# Altium project Shuttler_AFE.PrjPCB (part 1 of 2)
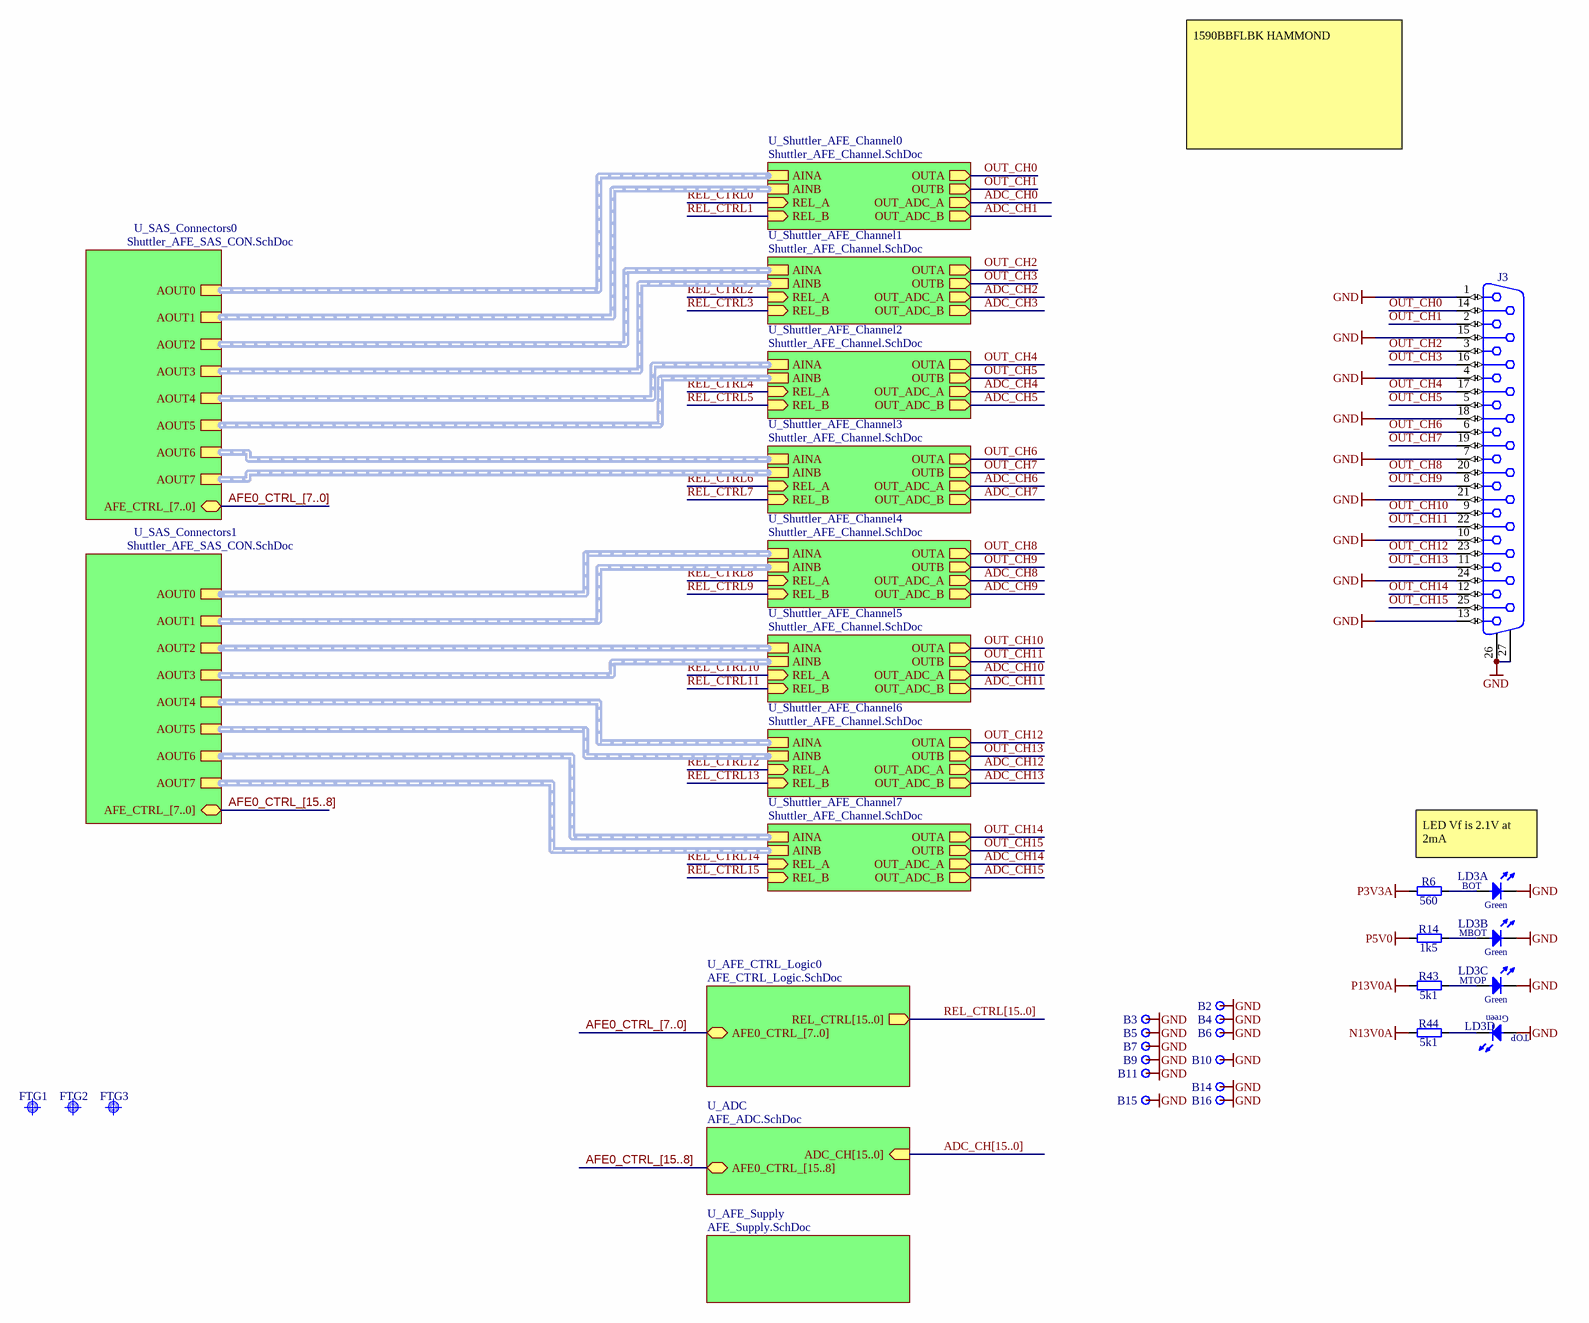
[diagram p0: Shuttler_AFE.SchDoc]
P_version: 1.2
6 sheets, 540 parts. Net scope: hierarchical (ports join the sheet entries above them; power ports are global).
Board file: Shuttler_AFE.PcbDoc
Sheets:
  Shuttler_AFE.SchDoc
    U_SAS_Connectors0 = Shuttler_AFE_SAS_CON.SchDoc
    U_SAS_Connectors1 = Shuttler_AFE_SAS_CON.SchDoc
    U_Shuttler_AFE_Channel0 = Shuttler_AFE_Channel.SchDoc
    U_AFE_CTRL_Logic0 = AFE_CTRL_Logic.SchDoc
    U_Shuttler_AFE_Channel1 = Shuttler_AFE_Channel.SchDoc
    U_Shuttler_AFE_Channel2 = Shuttler_AFE_Channel.SchDoc
    U_Shuttler_AFE_Channel3 = Shuttler_AFE_Channel.SchDoc
    U_Shuttler_AFE_Channel4 = Shuttler_AFE_Channel.SchDoc
    U_Shuttler_AFE_Channel5 = Shuttler_AFE_Channel.SchDoc
    U_Shuttler_AFE_Channel6 = Shuttler_AFE_Channel.SchDoc
    U_Shuttler_AFE_Channel7 = Shuttler_AFE_Channel.SchDoc
    U_ADC = AFE_ADC.SchDoc
    U_AFE_Supply = AFE_Supply.SchDoc

## Sheet Shuttler_AFE.SchDoc: Shuttler AFE
size 420 x 297 mm; Author: G.Kasprowicz; CompanyName: WUT ISE; DrawnBy: G.Kasprowicz; Organization: WUT ISE; Address1: PW ISE; Address2: Nowowiejska 15/19 00-665 Warsaw; Address3: gkasprow@gmail.com; DocumentNumber: 1; Revision: 1.2; SheetNumber: 1; SheetTotal: 6; ModifiedBy: -; CheckedDate: -; Title2: TOP; DivGrp: WUT ISE; Designer: G.Kasprowicz; ModifiedDate: -; ProjectName: Sensor Box

### Parts
B2  Plated Hole  [MTG270_500]  (value not drawn)  (no BOM)
B3  Plated Hole  [MTG270_500]  (value not drawn)  (no BOM)
B4  Plated Hole  [MTG270_500]  (value not drawn)  (no BOM)
B5  Plated Hole  [MTG270_500]  (value not drawn)  (no BOM)
B6  Plated Hole  [MTG270_500]  (value not drawn)  (no BOM)
B7  Plated Hole  [MTG270_500]  (value not drawn)  (no BOM)
B9  Plated Hole  [MTG270_500]  (value not drawn)  (no BOM)
B10  Plated Hole  [MTG270_500]  (value not drawn)  (no BOM)
B11  Plated Hole  [MTG270_500]  (value not drawn)  (no BOM)
B14  Plated Hole  [MTG270_500]  (value not drawn)  (no BOM)
B15  Plated Hole  [MTG270_500]  (value not drawn)  (no BOM)
B16  Plated Hole  [MTG270_500]  (value not drawn)  (no BOM)
FTG1  Use only in PCB  [FIDUCIAL_TOP_S100-200]  (value not drawn)
FTG2  Use only in PCB  [FIDUCIAL_TOP_S100-200]  (value not drawn)
FTG3  Use only in PCB  [FIDUCIAL_TOP_S100-200]  (value not drawn)
J3  D-Sub  [TYCO_3-1634586-2]  (value not drawn)
LD3  Green  [LED_BIVAR_H485CGDL]  (value not drawn)  (parts A,B,C,D of 4)
R6  560  [RESC1608X55N]
R14  1k5  [RESC1608X55N]
R43  5k1  [RESC1608X55N]
R44  5k1  [RESC1608X55N]

### Sub-sheets
U_ADC = AFE_ADC.SchDoc: ADC_CH[15..0] (in), AFE0_CTRL_[15..8] (bidir)
U_AFE_CTRL_Logic0 = AFE_CTRL_Logic.SchDoc: REL_CTRL[15..0] (out), AFE0_CTRL_[7..0] (bidir)
U_AFE_Supply = AFE_Supply.SchDoc: no entries
U_SAS_Connectors0 = Shuttler_AFE_SAS_CON.SchDoc: AOUT4 (harness DIFF), AOUT0 (harness DIFF), AOUT1 (harness DIFF), AOUT2 (harness DIFF), AOUT6 (harness DIFF), AOUT7 (harness DIFF), AFE_CTRL_[7..0] (bidir), AOUT3 (harness DIFF), AOUT5 (harness DIFF)
U_SAS_Connectors1 = Shuttler_AFE_SAS_CON.SchDoc: AOUT4 (harness DIFF), AOUT0 (harness DIFF), AOUT1 (harness DIFF), AOUT2 (harness DIFF), AOUT6 (harness DIFF), AOUT7 (harness DIFF), AFE_CTRL_[7..0] (bidir), AOUT3 (harness DIFF), AOUT5 (harness DIFF)
U_Shuttler_AFE_Channel0 = Shuttler_AFE_Channel.SchDoc: AINA (harness DIFF), OUTA (out), AINB (harness DIFF), OUTB (out), REL_A (in), REL_B (in), OUT_ADC_A (out), OUT_ADC_B (out)
U_Shuttler_AFE_Channel1 = Shuttler_AFE_Channel.SchDoc: AINA (harness DIFF), OUTA (out), AINB (harness DIFF), OUTB (out), REL_A (in), REL_B (in), OUT_ADC_A (out), OUT_ADC_B (out)
U_Shuttler_AFE_Channel2 = Shuttler_AFE_Channel.SchDoc: AINA (harness DIFF), OUTA (out), AINB (harness DIFF), OUTB (out), REL_A (in), REL_B (in), OUT_ADC_A (out), OUT_ADC_B (out)
U_Shuttler_AFE_Channel3 = Shuttler_AFE_Channel.SchDoc: AINA (harness DIFF), OUTA (out), AINB (harness DIFF), OUTB (out), REL_A (in), REL_B (in), OUT_ADC_A (out), OUT_ADC_B (out)
U_Shuttler_AFE_Channel4 = Shuttler_AFE_Channel.SchDoc: AINA (harness DIFF), OUTA (out), AINB (harness DIFF), OUTB (out), REL_A (in), REL_B (in), OUT_ADC_A (out), OUT_ADC_B (out)
U_Shuttler_AFE_Channel5 = Shuttler_AFE_Channel.SchDoc: AINA (harness DIFF), OUTA (out), AINB (harness DIFF), OUTB (out), REL_A (in), REL_B (in), OUT_ADC_A (out), OUT_ADC_B (out)
U_Shuttler_AFE_Channel6 = Shuttler_AFE_Channel.SchDoc: AINA (harness DIFF), OUTA (out), AINB (harness DIFF), OUTB (out), REL_A (in), REL_B (in), OUT_ADC_A (out), OUT_ADC_B (out)
U_Shuttler_AFE_Channel7 = Shuttler_AFE_Channel.SchDoc: AINA (harness DIFF), OUTA (out), AINB (harness DIFF), OUTB (out), REL_A (in), REL_B (in), OUT_ADC_A (out), OUT_ADC_B (out)

### Nets
GND: B2.1 B3.1 B4.1 B5.1 B6.1 B7.1 B9.1 B10.1 B11.1 B14.1 B15.1 B16.1 J3.1 J3.4 J3.7 J3.10 J3.13 J3.15 J3.18 J3.21 J3.24 J3.26 J3.27 LD3.1(C) LD3.3(C) LD3.5(C) LD3.8(A)
N13V0A: R44.1
P3V3A: R6.1
P5V0: R14.1
P13V0A: R43.1
OUT_CH0: J3.14 ; sheet U_Shuttler_AFE_Channel0/OUTA
OUT_CH1: J3.2 ; sheet U_Shuttler_AFE_Channel0/OUTB
OUT_CH2: J3.3 ; sheet U_Shuttler_AFE_Channel1/OUTA
OUT_CH3: J3.16 ; sheet U_Shuttler_AFE_Channel1/OUTB
OUT_CH4: J3.17 ; sheet U_Shuttler_AFE_Channel2/OUTA
OUT_CH5: J3.5 ; sheet U_Shuttler_AFE_Channel2/OUTB
OUT_CH6: J3.6 ; sheet U_Shuttler_AFE_Channel3/OUTA
OUT_CH7: J3.19 ; sheet U_Shuttler_AFE_Channel3/OUTB
OUT_CH8: J3.20 ; sheet U_Shuttler_AFE_Channel4/OUTA
OUT_CH9: J3.8 ; sheet U_Shuttler_AFE_Channel4/OUTB
OUT_CH10: J3.9 ; sheet U_Shuttler_AFE_Channel5/OUTA
OUT_CH11: J3.22 ; sheet U_Shuttler_AFE_Channel5/OUTB
OUT_CH12: J3.23 ; sheet U_Shuttler_AFE_Channel6/OUTA
OUT_CH13: J3.11 ; sheet U_Shuttler_AFE_Channel6/OUTB
OUT_CH14: J3.12 ; sheet U_Shuttler_AFE_Channel7/OUTA
OUT_CH15: J3.25 ; sheet U_Shuttler_AFE_Channel7/OUTB
NetLD3_2: LD3.2(A) R6.2
NetLD3_4: LD3.4(A) R14.2
NetLD3_6: LD3.6(A) R43.2
NetLD3_7: LD3.7(C) R44.2

### Buses and harness runs
bus ADC_CH[15..0] = sheet U_ADC/ADC_CH[15..0]
bus AFE0_CTRL_[7..0] = sheet U_AFE_CTRL_Logic0/AFE0_CTRL_[7..0]
bus AFE0_CTRL_[7..0] = sheet U_SAS_Connectors0/AFE_CTRL_[7..0]
bus AFE0_CTRL_[15..8] = sheet U_ADC/AFE0_CTRL_[15..8]
bus AFE0_CTRL_[15..8] = sheet U_SAS_Connectors1/AFE_CTRL_[7..0]
bus REL_CTRL[15..0] = sheet U_AFE_CTRL_Logic0/REL_CTRL[15..0]
harness sheet U_SAS_Connectors0/AOUT0 = sheet U_Shuttler_AFE_Channel0/AINA
harness sheet U_SAS_Connectors0/AOUT1 = sheet U_Shuttler_AFE_Channel0/AINB
harness sheet U_SAS_Connectors0/AOUT2 = sheet U_Shuttler_AFE_Channel1/AINA
harness sheet U_SAS_Connectors0/AOUT3 = sheet U_Shuttler_AFE_Channel1/AINB
harness sheet U_SAS_Connectors0/AOUT4 = sheet U_Shuttler_AFE_Channel2/AINA
harness sheet U_SAS_Connectors0/AOUT5 = sheet U_Shuttler_AFE_Channel2/AINB
harness sheet U_SAS_Connectors0/AOUT6 = sheet U_Shuttler_AFE_Channel3/AINA
harness sheet U_SAS_Connectors0/AOUT7 = sheet U_Shuttler_AFE_Channel3/AINB
harness sheet U_SAS_Connectors1/AOUT0 = sheet U_Shuttler_AFE_Channel4/AINA
harness sheet U_SAS_Connectors1/AOUT1 = sheet U_Shuttler_AFE_Channel4/AINB
harness sheet U_SAS_Connectors1/AOUT2 = sheet U_Shuttler_AFE_Channel5/AINA
harness sheet U_SAS_Connectors1/AOUT3 = sheet U_Shuttler_AFE_Channel5/AINB
harness sheet U_SAS_Connectors1/AOUT4 = sheet U_Shuttler_AFE_Channel6/AINA
harness sheet U_SAS_Connectors1/AOUT5 = sheet U_Shuttler_AFE_Channel6/AINB
harness sheet U_SAS_Connectors1/AOUT6 = sheet U_Shuttler_AFE_Channel7/AINA
harness sheet U_SAS_Connectors1/AOUT7 = sheet U_Shuttler_AFE_Channel7/AINB

### Notes on the sheet
- 1590BBFLBK HAMMOND
- LED Vf is 2.1V at 2mA
- Project/Equipment
- Document
- Designer
- Drawn by
- Check.by
- Copyright WUT ISE 2018.
  This documentation describes Open Hardware and is licensed under the CERN OHL v.1.1. You may redistribute and modify this documentation under the terms of the CERN OHL v.1.1. (http://ohwr.org/CERNOHL). This documentation is distributed WITHOUT ANY EXPRESS OR IMPLIED WARRANTY, INCLUDING OF MERCHANTABILITY, SATISFACTORY QUALITY AND FITNESS FOR A PARTICULAR PURPOSE. Please see the CERN OHL v.1.1 for applicable conditions.
- Contact
- File
- Last Mod.
- Print Date
- Sheet
- Size
- A3
- of
- Rev
- (in symbol LED_BIVAR_H485CGDL, part A) BOT
- (in symbol LED_BIVAR_H485CGDL, part B) MBOT
- (in symbol LED_BIVAR_H485CGDL, part C) MTOP
- (in symbol LED_BIVAR_H485CGDL, part D) TOP

### Library data of the parts
B2-B7 B9-B11 B14-B16 = PLATED_HOLE2.7_PAD5.0: Single Terminal Socket; Part Description: Plated Through Hole: Hole Dia.=2.7mm Pad Dia.=5.0mm; Mounted: No; Part Number: PLATED_HOLE2.7_PAD5.0; Component Type: Standard (No BOM); Pin Count: 1; Family: Plated Hole; Socket: No; SMD: No; Sense: No; Status: None; ComponentHeight: 0mm; HelpURL: Undefined; Author: CERN DEM JMW; CreateDate: 27.09.2011; LatestRevisionDate: 27.09.2011; PackageDescription: Plated Through Hole: Hole Dia.=2.7mm Pad Dia.=5.0mm
FTG1-FTG3 = FIDUCIAL_TARGET_S100-200: Fiducial Target; Part Description: Square Fiducial Target, Top Layer, 1.0mm, Top Solder 2.0mm, Keepout =2.0mm; Mounted: No; Table: Pads; Part Number: FIDUCIAL_TARGET_S100-200; Component Kind: Standard (No BOM); Component Type: Standard (No BOM); Pin Count: 1; Family: Fiducial; Socket: No; SMD: Yes; Status: None; ComponentHeight: 0mm; Author: CERN DEM JLC; CreateDate: 9/2/2010; LatestRevisionDate: 4/4/2012; PackageDescription: Square Fiducial Target, Top Layer, 1.0mm, Top Solder 2.0mm, Keepout =2.0mm
J3 = TYCO_3-1634586-2: Connector D-sub 25 Female; Part Description: Right Angle 25 Female Contacts D-SUB Connector With Boardlock and 4-40 UNC Screwlocks; Manufacturer: TYCO ELECTRONICS; PressFit: No; Part Number: TYCO_3-1634586-2; Component Kind: Standard; Component Type: Standard; Pin Count: 27; Family: D-Sub; Mounted: Yes; Socket: No; SMD: No; Sense: No; Status: None; Manufacturer Part Number: 3-1634586-2; ComponentHeight: 13.57mm; HelpURL: \\cern.ch\dfs\Applications\Altium\Datasheets\TYCO_3-1634586-2.pdf; Author: CERN DEM JLC; CreateDate: 16.01.2013; LatestRevisionDate: 16.01.2013
LD3 = LED_BIVAR_H485CGDL: LED x4 Green 1C2A-BOT_3C4A_5C6A_7C8A-TOP; Part Description: Quad-Level 2mm Green LED, PCB Edge Mounting; Manufacturer: BIVAR; PressFit: No; Bonding: No; Part Number: LED_BIVAR_H485CGDL; Component Kind: Standard; Component Type: Standard; Color: Green; PackageDescription: Quad-Level 2mm Green, PCB Edge Mounting  BIVAR H485CHDL; Manufacturer Part Number: H485CGDL; Pin Count: 8; Mounted: Yes; Socket: No; SMD: No; Sense: No; ComponentHeight: 11.3mm; HelpURL: \\cern.ch\dfs\Applications\Altium\Datasheets\LED_BIVAR_H485CGDL.pdf; Author: CERN DEM JLC; CreateDate: 04.06.2012; LatestRevisionDate: 04.06.2012
R6 = R0603_560R_1%_0.1W_100PPM: Resistor - 1%; Part Description: General Purpose Thick Film Chip Resistor; Manufacturer: GENERIC; Manufacturer1 Part Number: NRC06F5600TRF; Power: 0.1W; TC: ±100ppm/°C; PressFit: No; Part Number: R0603_560R_1%_0.1W_100PPM; Component Kind: Standard; Component Type: Standard; Pin Count: 2; Value: 560; Status: Preferred; Tolerance: ±1%; Manufacturer Part Number: R0603_560R_1%_0.1W_100PPM; Case: 0603; Mounted: Yes; Sense: No; Socket: No; SMD: Yes; Manufacturer1 Example: NIC COMPONENT; Manufacturer1 ComponentHeight: 0.55mm; HelpURL: \\cern.ch\dfs\Applications\Altium\Datasheets\R0603_NIC_NRC.pdf; Author: CERN DEM JLC; CreateDate: 03.12.2007; LatestRevisionDate: 13.03.2008
R14 = R0603_1K5_1%_0.1W_100PPM: Resistor - 1%; Part Description: General Purpose Thick Film Chip Resistor; Manufacturer: GENERIC; Manufacturer1 Part Number: NRC06F1501TRF; Power: 0.1W; TC: ±100ppm/°C; PressFit: No; Part Number: R0603_1K5_1%_0.1W_100PPM; Component Kind: Standard; Component Type: Standard; Pin Count: 2; Value: 1k5; Status: Preferred; Tolerance: ±1%; Manufacturer Part Number: R0603_1K5_1%_0.1W_100PPM; Case: 0603; Mounted: Yes; Sense: No; Socket: No; SMD: Yes; Manufacturer1 Example: NIC COMPONENT; Manufacturer1 ComponentHeight: 0.55mm; HelpURL: \\cern.ch\dfs\Applications\Altium\Datasheets\R0603_NIC_NRC.pdf; Author: CERN DEM JLC; CreateDate: 03.12.2007; LatestRevisionDate: 13.03.2008
R43 R44 = R0603_5k1_1%_0.1W_100PPM: Resistor - 1%; Part Description: General Purpose Thick Film Chip Resistor; Manufacturer: GENERIC; Manufacturer1 Part Number: NRC06F5101TRF; Power: 0.1W; TC: ±100ppm/°C; PressFit: No; Part Number: R0603_5K1_1%_0.1W_100PPM; Component Kind: Standard; Component Type: Standard; Pin Count: 2; Value: 5k1; Status: Preferred; Tolerance: ±1%; Manufacturer Part Number: R0603_5K1_1%_0.1W_100PPM; Case: 0603; Mounted: Yes; Sense: No; Socket: No; SMD: Yes; Manufacturer1 Example: NIC COMPONENT; Manufacturer1 ComponentHeight: 0.55mm; HelpURL: \\cern.ch\dfs\Applications\Altium\Datasheets\R0603_NIC_NRC.pdf; Author: CERN DEM JLC; CreateDate: 03.12.2007; LatestRevisionDate: 13.03.2008

## Sheet Shuttler_AFE_SAS_CON.SchDoc: Shuttler AFE
size A4; Author: G.Kasprowicz; CompanyName: WUT ISE; DrawnBy: G.Kasprowicz; Organization: WUT ISE; Address1: PW ISE; Address2: Nowowiejska 15/19 00-665 Warsaw; Address3: gkasprow@gmail.com; DocumentNumber: 6; Revision: 1.2; SheetNumber: 6; SheetTotal: 6; ModifiedBy: -; CheckedDate: -; Title2: SAS connectors; DivGrp: WUT ISE; Designer: G.Kasprowicz; ModifiedDate: -; ProjectName: Sensor Box
Used 2 times, as channels U_SAS_Connectors0, U_SAS_Connectors1. Parts and nets are listed once, with the designators drawn on the sheet.
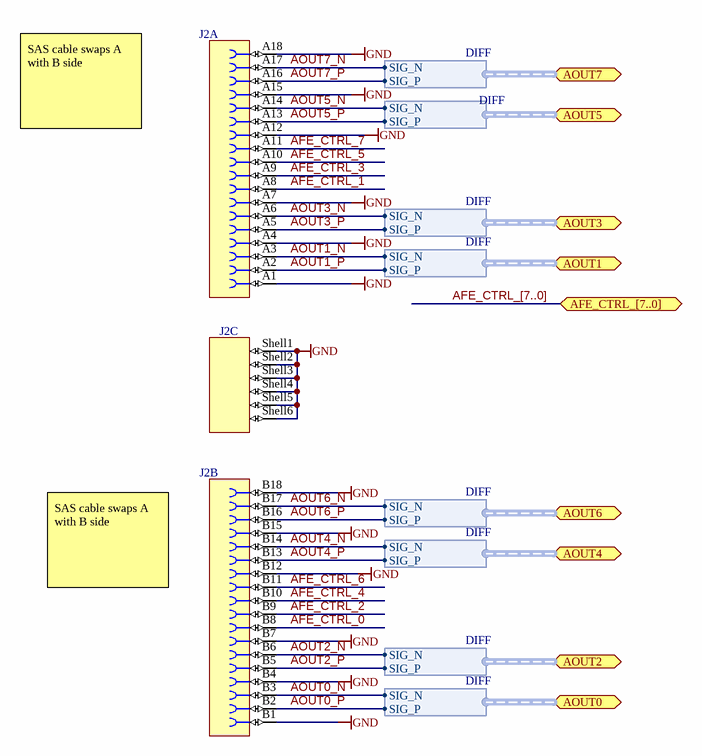
[diagram p1: Shuttler_AFE_SAS_CON.SchDoc]

### Parts
J2  iPass™  [MOLEX_75783-0107]  (value not drawn)  (parts A,B,C of 3)

### Ports
AFE_CTRL_[7..0] (bidir), AOUT0 (bidir, harness DIFF), AOUT1 (bidir, harness DIFF), AOUT2 (bidir, harness DIFF), AOUT3 (bidir, harness DIFF), AOUT4 (bidir, harness DIFF), AOUT5 (bidir, harness DIFF), AOUT6 (bidir, harness DIFF), AOUT7 (bidir, harness DIFF)

### Harnesses
DIFF: SIG_P, SIG_N

### Nets
GND: J2.A1 J2.A4 J2.A7 J2.A12 J2.A15 J2.A18 J2.B1 J2.B4 J2.B7 J2.B12 J2.B15 J2.B18 J2.Shell1 J2.Shell2 J2.Shell3 J2.Shell4 J2.Shell5 J2.Shell6
AFE_CTRL_0: J2.B8
AFE_CTRL_1: J2.A8
AFE_CTRL_2: J2.B9
AFE_CTRL_3: J2.A9
AFE_CTRL_4: J2.B10
AFE_CTRL_5: J2.A10
AFE_CTRL_6: J2.B11
AFE_CTRL_7: J2.A11
AOUT0_N: J2.B3 ; port AOUT0.SIG_N
AOUT0_P: J2.B2 ; port AOUT0.SIG_P
AOUT1_N: J2.A3 ; port AOUT1.SIG_N
AOUT1_P: J2.A2 ; port AOUT1.SIG_P
AOUT2_N: J2.B6 ; port AOUT2.SIG_N
AOUT2_P: J2.B5 ; port AOUT2.SIG_P
AOUT3_N: J2.A6 ; port AOUT3.SIG_N
AOUT3_P: J2.A5 ; port AOUT3.SIG_P
AOUT4_N: J2.B14 ; port AOUT4.SIG_N
AOUT4_P: J2.B13 ; port AOUT4.SIG_P
AOUT5_N: J2.A14 ; port AOUT5.SIG_N
AOUT5_P: J2.A13 ; port AOUT5.SIG_P
AOUT6_N: J2.B17 ; port AOUT6.SIG_N
AOUT6_P: J2.B16 ; port AOUT6.SIG_P
AOUT7_N: J2.A17 ; port AOUT7.SIG_N
AOUT7_P: J2.A16 ; port AOUT7.SIG_P

### Channels
U_SAS_Connectors0: designators end in A
U_SAS_Connectors1: designators end in B

### Buses and harness runs
bus AFE_CTRL_[7..0] = port AFE_CTRL_[7..0]

### Notes on the sheet
- SAS cable swaps A with B side
- Project/Equipment
- Document
- Designer
- Drawn by
- Check.by
- Copyright WUT ISE 2020.
  This documentation describes Open Hardware and is licensed under the CERN OHL v.1.2. You may redistribute and modify this documentation under the terms of the CERN OHL v.1.2. (http://ohwr.org/CERNOHL). This documentation is distributed WITHOUT ANY EXPRESS OR IMPLIED WARRANTY, INCLUDING OF MERCHANTABILITY, SATISFACTORY QUALITY AND FITNESS FOR A PARTICULAR PURPOSE. Please see the CERN OHL v.1.2 for applicable conditions.
- Contact
- File
- Last Mod.
- Print Date
- Sheet
- Size
- A3
- of
- Rev

### Library data of the parts
J2 = MOLEX_75783-0107: 36 Circuit, Right Angle , Internal Assembly, iPass™ I/O Surface Mount Receptacle with Left Key Shell; Part Number: MOLEX 75783-0107 / 75783-0136; Manufacturer: MOLEX; Manufacturer Part Number: 75783-0107 / 75783-0136; PressFit: No; Component Kind: Standard; Component Type: Standard; Pin Count: 42; Family: iPass™; Mounted: Yes; Socket: No; SMD: Yes; Sense: No; Status: None; Part Description: 36 Circuit, Right Angle , Internal Assembly, iPass™ I/O Surface Mount Receptacle with Left Key Shell; ComponentHeight: 8.47mm; HelpURL: \\cern.ch\dfs\Applications\Altium\Datasheets\MOLEX_75783-0107.pdf; Author: CERN DEM JLC; CreateDate: 12.11.2014; LatestRevisionDate: 12.11.2014

## Sheet Shuttler_AFE_Channel.SchDoc: Shuttler AFE
size 420 x 297 mm; Author: G.Kasprowicz; CompanyName: WUT ISE; DrawnBy: G.Kasprowicz; Organization: WUT ISE; Address1: PW ISE; Address2: Nowowiejska 15/19 00-665 Warsaw; Address3: gkasprow@gmail.com; DocumentNumber: 5; Revision: 1.2; SheetNumber: 5; SheetTotal: 6; ModifiedBy: -; CheckedDate: -; Title2: Channel; DivGrp: WUT ISE; Designer: G.Kasprowicz; ModifiedDate: -; ProjectName: Sensor Box
Used 8 times, as channels U_Shuttler_AFE_Channel0, U_Shuttler_AFE_Channel1, U_Shuttler_AFE_Channel2, U_Shuttler_AFE_Channel3, U_Shuttler_AFE_Channel4, U_Shuttler_AFE_Channel5, U_Shuttler_AFE_Channel6, U_Shuttler_AFE_Channel7. Parts and nets are listed once, with the designators drawn on the sheet.
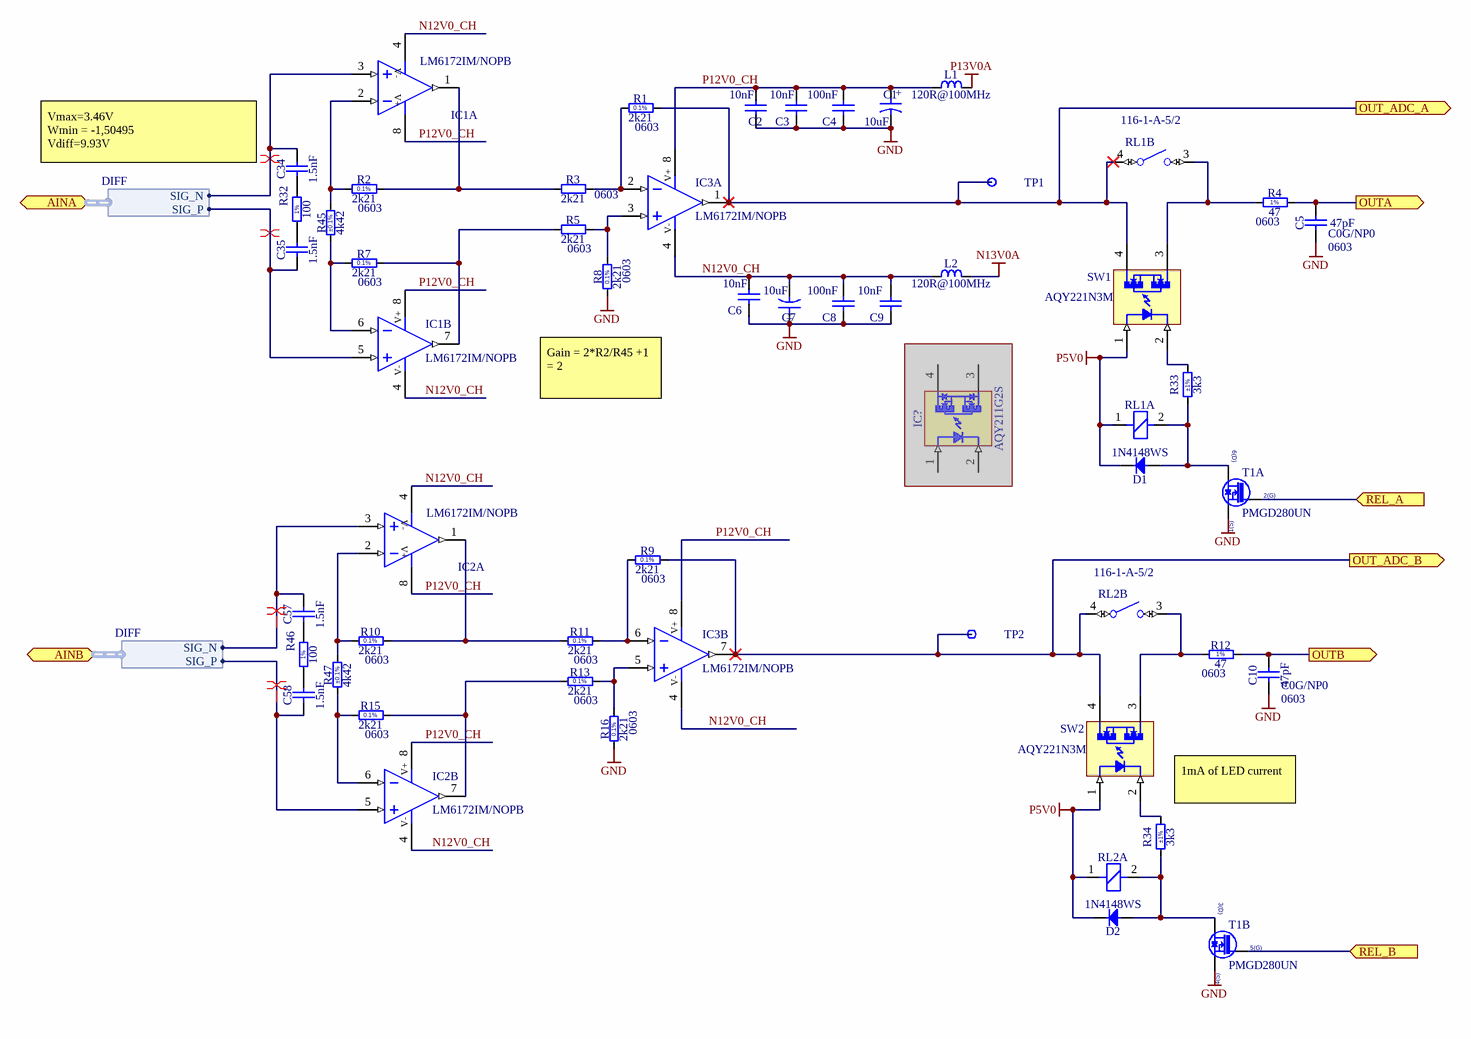
[diagram p2: Shuttler_AFE_Channel.SchDoc]

### Parts
C1  10uF  [CAPMP3216X180N]
C2  10nF  [CAPC1005X55N]
C3  10nF  [CAPC1005X55N]
C4  100nF  [CAPC1005X55N]
C5  47pF  TC: C0G/NP0  Case: 0603  [CAPC1608X87N]
C6  10nF  [CAPC1005X55N]
C7  10uF  [CAPMP3216X180N]
C8  100nF  [CAPC1005X55N]
C9  10nF  [CAPC1005X55N]
C10  47pF  TC: C0G/NP0  Case: 0603  [CAPC1608X87N]
C34  1.5nF  [CAPC1608X87N]
C35  1.5nF  [CAPC1608X87N]
C57  1.5nF  [CAPC1608X87N]
C58  1.5nF  [CAPC1608X87N]
D1  1N4148WS  [SODFL2512X100N]
D2  1N4148WS  [SODFL2512X100N]
IC1  LM6172IM/NOPB  [SOIC127P600X175-8N]  (parts A,B of 2)
IC2  LM6172IM/NOPB  [SOIC127P600X175-8N]  (parts A,B of 2)
IC3  LM6172IM/NOPB  [SOIC127P600X175-8N]  (parts A,B of 2)
IC?  AQY211G2S  [PANASONIC_AQY21(SOP)]  (masked out: inside a compile mask, not in the netlist)
L1  120R@100MHz  [INDC1608X95N]
L2  120R@100MHz  [INDC1608X95N]
R1  2k21  Case: 0603  [RESC1608X55N]
R2  2k21  Case: 0603  [RESC1608X55N]
R3  2k21  Case: 0603  [RESC1608X55N]
R4  47  Case: 0603  [RESC1608X55N]
R5  2k21  Case: 0603  [RESC1608X55N]
R7  2k21  Case: 0603  [RESC1608X55N]
R8  2k21  Case: 0603  [RESC1608X55N]
R9  2k21  Case: 0603  [RESC1608X55N]
R10  2k21  Case: 0603  [RESC1608X55N]
R11  2k21  Case: 0603  [RESC1608X55N]
R12  47  Case: 0603  [RESC1608X55N]
R13  2k21  Case: 0603  [RESC1608X55N]
R15  2k21  Case: 0603  [RESC1608X55N]
R16  2k21  Case: 0603  [RESC1608X55N]
R32  100  [RESC1608X55N]
R33  3k3  Tolerance: ±1%  [RESC1005X40N]
R34  3k3  Tolerance: ±1%  [RESC1005X40N]
R45  4k42  Tolerance: ±0.1%  [RESC1608X55N]
R46  100  [RESC1608X55N]
R47  4k42  Tolerance: ±0.1%  [RESC1608X55N]
RL1  REL_PICKERING_116-1-A-5/2  [REL_PICKERING_116-1-A]  (value not drawn)  (parts A,B of 2)
RL2  REL_PICKERING_116-1-A-5/2  [REL_PICKERING_116-1-A]  (value not drawn)  (parts A,B of 2)
SW1  AQY221N3M  [PANASONIC_AQY22(SON)]
SW2  AQY221N3M  [PANASONIC_AQY22(SON)]
T1  PMGD280UN  [SOT65P210X110-6N]  (parts A,B of 2)
TP1  Test Point  [TPS127]  (value not drawn)  (no BOM)
TP2  Test Point  [TPS127]  (value not drawn)  (no BOM)

### Ports
AINA (bidir, harness DIFF), AINB (bidir, harness DIFF), OUT_ADC_A (out), OUT_ADC_B (out), OUTA (out), OUTB (out), REL_A (in), REL_B (in)

### Harnesses
DIFF: SIG_P, SIG_N

### Nets
GND: C1.2 C2.2 C3.2 C4.2 C5.1 C6.2 C7.1 C8.2 C9.2 C10.1 R8.1 R16.1 T1.1(S) T1.4(S)
N13V0A: L2.2
P5V0: D1.1(C) D2.1(C) RL1.1(BO) RL2.1(BO) SW1.1(A) SW2.1(A)
P13V0A: L1.2
N12V0_CH: C6.1 C7.2 C8.1 C9.1 IC1.4(V-) IC2.4(V-) IC3.4(V-) L2.1
OUT_ADC_A: IC3.1(OUT) R1.2 RL1.4(C) SW1.4(E) TP1.1 ; port OUT_ADC_A
OUT_ADC_B: IC3.7(OUT) R9.2 RL2.4(C) SW2.4(E) TP2.1 ; port OUT_ADC_B
OUTA: C5.2 R4.2 ; port OUTA
OUTB: C10.2 R12.2 ; port OUTB
P12V0_CH: C1.1 C2.1 C3.1 C4.1 IC1.8(V+) IC2.8(V+) IC3.8(V+) L1.1
REL_A: T1.2(G) ; port REL_A
REL_B: T1.5(G) ; port REL_B
NetC34_1: C34.1 R32.2
NetC34_2: C34.2 IC1.3(IN+) ; port AINA.SIG_N
NetC35_1: C35.1 IC1.5(IN+) ; port AINA.SIG_P
NetC35_2: C35.2 R32.1
NetC57_1: C57.1 R46.2
NetC57_2: C57.2 IC2.3(IN+) ; port AINB.SIG_N
NetC58_1: C58.1 IC2.5(IN+) ; port AINB.SIG_P
NetC58_2: C58.2 R46.1
NetD1_2: D1.2(A) R33.1 RL1.2(BO) T1.6(D)
NetD2_2: D2.2(A) R34.1 RL2.2(BO) T1.3(D)
NetIC1_1: IC1.1(OUT) R2.2 R3.1
NetIC1_2: IC1.2(IN-) R2.1 R45.2
NetIC1_6: IC1.6(IN-) R7.1 R45.1
NetIC1_7: IC1.7(OUT) R5.1 R7.2
NetIC2_1: IC2.1(OUT) R10.2 R11.1
NetIC2_2: IC2.2(IN-) R10.1 R47.2
NetIC2_6: IC2.6(IN-) R15.1 R47.1
NetIC2_7: IC2.7(OUT) R13.1 R15.2
NetIC3_2: IC3.2(IN-) R1.1 R3.2
NetIC3_3: IC3.3(IN+) R5.2 R8.2
NetIC3_5: IC3.5(IN+) R13.2 R16.2
NetIC3_6: IC3.6(IN-) R9.1 R11.2
NetR4_1: R4.1 RL1.3(NO) SW1.3(C)
NetR12_1: R12.1 RL2.3(NO) SW2.3(C)
NetR33_2: R33.2 SW1.2(K)
NetR34_2: R34.2 SW2.2(K)

### Channels
U_Shuttler_AFE_Channel0: designators end in A; ports OUT_ADC_A=ADC_CH0 OUT_ADC_B=ADC_CH1 OUTA=OUT_CH0 OUTB=OUT_CH1 REL_A=REL_CTRL0 REL_B=REL_CTRL1
U_Shuttler_AFE_Channel1: designators end in B; ports OUT_ADC_A=ADC_CH2 OUT_ADC_B=ADC_CH3 OUTA=OUT_CH2 OUTB=OUT_CH3 REL_A=REL_CTRL2 REL_B=REL_CTRL3
U_Shuttler_AFE_Channel2: designators end in C; ports OUT_ADC_A=ADC_CH4 OUT_ADC_B=ADC_CH5 OUTA=OUT_CH4 OUTB=OUT_CH5 REL_A=REL_CTRL4 REL_B=REL_CTRL5
U_Shuttler_AFE_Channel3: designators end in D; ports OUT_ADC_A=ADC_CH6 OUT_ADC_B=ADC_CH7 OUTA=OUT_CH6 OUTB=OUT_CH7 REL_A=REL_CTRL6 REL_B=REL_CTRL7
U_Shuttler_AFE_Channel4: designators end in E; ports OUT_ADC_A=ADC_CH8 OUT_ADC_B=ADC_CH9 OUTA=OUT_CH8 OUTB=OUT_CH9 REL_A=REL_CTRL8 REL_B=REL_CTRL9
U_Shuttler_AFE_Channel5: designators end in F; ports OUT_ADC_A=ADC_CH10 OUT_ADC_B=ADC_CH11 OUTA=OUT_CH10 OUTB=OUT_CH11 REL_A=REL_CTRL10 REL_B=REL_CTRL11
U_Shuttler_AFE_Channel6: designators end in G; ports OUT_ADC_A=ADC_CH12 OUT_ADC_B=ADC_CH13 OUTA=OUT_CH12 OUTB=OUT_CH13 REL_A=REL_CTRL12 REL_B=REL_CTRL13
U_Shuttler_AFE_Channel7: designators end in H; ports OUT_ADC_A=ADC_CH14 OUT_ADC_B=ADC_CH15 OUTA=OUT_CH14 OUTB=OUT_CH15 REL_A=REL_CTRL14 REL_B=REL_CTRL15

### Layout directives
differential pair: AOUT0_N, AOUT0_P, AOUT1_N, AOUT1_P

### Notes on the sheet
- Vmax=3.46V
  Wmin = -1,50495
  Vdiff=9.93V
- (near R8) Gain = 2*R2/R45 +1 = 2
- 1mA of LED current
- Project/Equipment
- Document
- Designer
- Drawn by
- Check.by
- Copyright WUT ISE 2020.
  This documentation describes Open Hardware and is licensed under the CERN OHL v.1.2. You may redistribute and modify this documentation under the terms of the CERN OHL v.1.2. (http://ohwr.org/CERNOHL). This documentation is distributed WITHOUT ANY EXPRESS OR IMPLIED WARRANTY, INCLUDING OF MERCHANTABILITY, SATISFACTORY QUALITY AND FITNESS FOR A PARTICULAR PURPOSE. Please see the CERN OHL v.1.2 for applicable conditions.
- Contact
- File
- Last Mod.
- Print Date
- Sheet
- Size
- A3
- of
- Rev
- (in symbol CTE3216-18_10UF_10V_10%_LESR1800) +
- (in symbol PMGD280UN, part A) 6(D); 2(G); 1(S)
- (in symbol PMGD280UN, part B) 3(D); 5(G); 4(S)
- (in symbol R0603_2K21_0.1%_0.063W_10PPM) 0.1%
- (in symbol R0603_47R_1%_0.1W_100PPM) 1%
- (in symbol R0603_100R_1%_0.1W_100PPM) 1%

### Library data of the parts
C1 C7 = CTE3216-18_10UF_10V_10%_LESR1800: Polarised capacitor; Part Description: Low ESR 1R8 Solid Tantalum Chip Capacitor; Manufacturer: GENERIC; Manufacturer1 Part Number: TPSA106K010R1800; Voltage: 10V; Tolerance: ±10%; Part Number: CTE3216-18_10UF_10V_10%_LESR1800; Component Kind: Standard; Component Type: Standard; Pin Count: 2; Value: 10uF; Status: Preferred; Manufacturer Part Number: CTE3216-18_10UF_10V_10%_LESR1800; Case: A; Mounted: Yes; Socket: No; SMD: Yes; Sense: No; Manufacturer1 Example: AVX; Manufacturer1 ComponentHeight: 1.8mm; HelpURL: \\cern.ch\dfs\Applications\Altium\Datasheets\CTE-LESR_AVX_TPS.pdf; Author: CERN DEM JLC; CreateDate: 05.05.2008; LatestRevisionDate: 20.01.2009
C2 C3 C6 C9 = CC0402_10NF_16V_10%_X7R: Non-polarised capacitor; Part Description: SMD Multilayer Chip Ceramic Capacitor; Manufacturer: GENERIC; Manufacturer1 Part Number: 223878715636; Voltage: 16V; TC: X7R; Tolerance: ±10%; Part Number: CC0402_10NF_16V_10%_X7R; Component Kind: Standard; Component Type: Standard; Pin Count: 2; Value: 10nF; Status: Not Recommended; Manufacturer Part Number: CC0402_10NF_16V_10%_X7R; Case: 0402; Mounted: Yes; Socket: No; SMD: Yes; Sense: No; Manufacturer1 Example: PHYCOMP; Manufacturer1 ComponentHeight: 0.55mm; HelpURL: \\cern.ch\dfs\Applications\Altium\Datasheets\CC0402_X7R_PHYCOMP.pdf; Author: CERN DEM JLC; CreateDate: 03.12.2007; LatestRevisionDate: 03.12.2007
C4 C8 = CC0402_100NF_16V_10%_X5R: Non-polarised capacitor; Part Description: SMD Multilayer Chip Ceramic Capacitor; Manufacturer: GENERIC; Manufacturer1 Part Number: GRM155R61C104KA88D; Voltage: 16V; TC: X5R; Tolerance: ±10%; Part Number: CC0402_100NF_16V_10%_X5R; Component Kind: Standard; Component Type: Standard; Pin Count: 2; Value: 100nF; Status: None; Manufacturer Part Number: CC0402_100NF_16V_10%_X5R; Case: 0402; Mounted: Yes; Socket: No; SMD: Yes; Sense: No; Manufacturer1 Example: MURATA; Manufacturer1 ComponentHeight: 0.55mm; HelpURL: \\cern.ch\dfs\Applications\Altium\Datasheets\CC0402_X5R_MURATA_GRM.pdf; Author: CERN DEM JLC; CreateDate: 10.12.2013; LatestRevisionDate: 10.12.2013
C5 C10 = CC0603_47PF_50V_5%_NP0: Non-polarised capacitor; Part Description: SMD Multilayer Chip Ceramic Capacitor; Manufacturer: GENERIC; Manufacturer1 Part Number: 223886715479; Voltage: 50V; Tolerance: ±5%; Part Number: CC0603_47PF_50V_5%_NP0; Component Kind: Standard; Component Type: Standard; Pin Count: 2; Value: 47pF; Status: Preferred; Manufacturer Part Number: CC0603_47PF_50V_5%_NP0; Mounted: Yes; Socket: No; SMD: Yes; Sense: No; Manufacturer1 Example: PHYCOMP; Manufacturer1 ComponentHeight: 0.87mm; HelpURL: \\cern.ch\dfs\Applications\Altium\Datasheets\CC0603_NP0_PHYCOMP.pdf; Author: CERN DEM JLC; CreateDate: 03.12.2007; LatestRevisionDate: 03.12.2007
C34 C35 C57 C58 = CC0603_1.5NF_50V_5%_NP0: Non-polarised capacitor; Part Description: SMD Multilayer Chip Ceramic Capacitor; Manufacturer: GENERIC; Manufacturer1 Part Number: GRM1885C1H152JA01D; Voltage: 50V; TC: C0G/NP0; Tolerance: ±5%; Part Number: CC0603_1.5NF_50V_5%_NP0; Component Kind: Standard; Component Type: Standard; Pin Count: 2; Value: 1.5nF; Status: None; Manufacturer Part Number: CC0603_1.5NF_50V_5%_NP0; Case: 0603; Mounted: Yes; Socket: No; SMD: Yes; Sense: No; Manufacturer1 Example: MURATA; Manufacturer1 ComponentHeight: 0.9mm; HelpURL: \\cern.ch\dfs\Applications\Altium\Datasheets\CC0603_NP0_MURATA.pdf; Author: CERN DEM JLC; CreateDate: 08.02.2011; LatestRevisionDate: 08.02.2011
D1 D2 = 1N4148WS: Diode; Part Description: Small Signal Diodes; Manufacturer: FAIRCHILD SEMICONDUCTOR; Voltage: 75V; Power: 150mA; PressFit: No; Bonding: No; Part Number: 1N4148WS; Component Kind: Standard; Component Type: Standard; Device: 1N4148WS; PackageDescription: SODFL Diode (SOD323F); 1.70mm W X 1.25mm L X 1.00mm H body, IPC Medium Density; Manufacturer Part Number: 1N4148WS; Pin Count: 2; Case: SOD-323F; Mounted: Yes; Socket: No; SMD: Yes; Sense: No; ComponentHeight: 1mm; HelpURL: \\cern.ch\dfs\Applications\Altium\Datasheets\1N4148WS.pdf; Author: CERN DEM JLC; CreateDate: 12.05.2011; LatestRevisionDate: 12.05.2011
IC1-IC3 = LM6172IM/NOPB: Dual Operational Amplifier; Part Description: Dual High Speed, Low Power, Low Distortion Voltage Feedback Amplifiers; Manufacturer: TEXAS INSTRUMENTS; PressFit: No; Bonding: No; Part Number: LM6172IM/NOPB; Component Kind: Standard; Component Type: Standard; Device: LM6172IM/NOPB; PackageDescription: SOIC 8, Pitch 1.27mm - Body 4x5mm, IPC Medium Density; Manufacturer Part Number: LM6172IM/NOPB; Pin Count: 8; Case: SOIC8; Mounted: Yes; Socket: No; SMD: Yes; Sense: No; ComponentHeight: 1.75mm; Author: CERN DEM MR; HelpURL: \\cern.ch\dfs\Applications\Altium\Datasheets\LM6172IM-NOPB.pdf; CreateDate: 08.08.2019; LatestRevisionDate: 08.08.2019
IC? = AQY211G2S: PhotoMOS Relay; Part Description: GU 1 Form A, PhotoMOS Relay, High Capacity, 40V 1.6A; Manufacturer: PANASONIC; PressFit: No; Bonding: No; Part Number: AQY211G2S; Component Kind: Standard; Component Type: Standard; Device: AQY211G2S; PackageDescription: PANASONIC Serie AQY21(SOP), 2.54mm Pitch; 4 Pin, 4.40mm W X 4.30mm L X 2.30mm H body; Manufacturer Part Number: AQY211G2S; Pin Count: 4; Case: SOP4; Mounted: Yes; Socket: No; SMD: Yes; Sense: No; ComponentHeight: 2.3mm; HelpURL: \\cern.ch\dfs\Applications\Altium\Datasheets\AQY211G2S.pdf; ComponentLink1Description: Package Drawing; ComponentLink1URL: \\cern.ch\dfs\Applications\Altium\Datasheets\AQY21_Package-Drawing.pdf; Author: CERN DEM BC; CreateDate: 13.10.2020; LatestRevisionDate: 13.10.2020
L1 L2 = IND0603_MURATA_BLM18PG121SN1D: Inductor; Part Description: SMD EMIFIL Chip Ferrite Bead; Manufacturer: MURATA; Power: 2A; Resistance: 0.05R; Part Number: IND0603_MURATA_BLM18PG121SN1D; Component Kind: Standard; Component Type: Standard; Pin Count: 2; Value: 120R@100MHz; Status: None; Manufacturer Part Number: BLM18PG121SN1D; Case: 0603; Mounted: Yes; Socket: No; SMD: Yes; Sense: No; ComponentHeight: 0.95mm; HelpURL: \\cern.ch\dfs\Applications\Altium\Datasheets\IND0603_MURATA_BLM18P.pdf; Author: CERN DEM BC; CreateDate: 27.07.2015; LatestRevisionDate: 27.07.2015
R1-R3 R5 R7-R11 R13 R15 R16 = R0603_2K21_0.1%_0.063W_10PPM: Resistor - 0.1%; Part Description: Thin Film Chip Resistor; Manufacturer: GENERIC; Manufacturer1 Part Number: RN73C1J2K21BTDF; Power: 0.063W; TC: ±10ppm; PressFit: No; Part Number: R0603_2K21_0.1%_0.063W_10PPM; Component Kind: Standard; Component Type: Standard; Pin Count: 2; Value: 2k21; Status: Not Recommended; Tolerance: ±0.1%; Manufacturer Part Number: R0603_2K21_0.1%_0.063W_10PPM; Mounted: Yes; Sense: No; Socket: No; SMD: Yes; Manufacturer1 Example: TYCO HOLSWORTHY; Manufacturer1 ComponentHeight: 0.5mm; HelpURL: \\cern.ch\dfs\Applications\Altium\Datasheets\R0603_Tyco_RN73.pdf; Author: CERN DEM JLC; CreateDate: 03.12.2007; LatestRevisionDate: 13.03.2008
R4 R12 = R0603_47R_1%_0.1W_100PPM: Resistor - 1%; Part Description: General Purpose Thick Film Chip Resistor; Manufacturer: GENERIC; Manufacturer1 Part Number: NRC06F47R0TRF; Power: 0.1W; TC: ±100ppm/°C; PressFit: No; Part Number: R0603_47R_1%_0.1W_100PPM; Component Kind: Standard; Component Type: Standard; Pin Count: 2; Value: 47; Status: Preferred; Tolerance: ±1%; Manufacturer Part Number: R0603_47R_1%_0.1W_100PPM; Mounted: Yes; Sense: No; Socket: No; SMD: Yes; Manufacturer1 Example: NIC COMPONENT; Manufacturer1 ComponentHeight: 0.55mm; HelpURL: \\cern.ch\dfs\Applications\Altium\Datasheets\R0603_NIC_NRC.pdf; Author: CERN DEM JLC; CreateDate: 03.12.2007; LatestRevisionDate: 13.03.2008
R32 R46 = R0603_100R_1%_0.1W_100PPM: Resistor - 1%; Part Description: General Purpose Thick Film Chip Resistor; Manufacturer: GENERIC; Manufacturer1 Part Number: NRC06F4700TRF; Power: 0.1W; TC: ±100ppm/°C; PressFit: No; Part Number: R0603_100R_1%_0.1W_100PPM; Component Kind: Standard; Component Type: Standard; Pin Count: 2; Value: 100; Status: Preferred; Tolerance: ±1%; Manufacturer Part Number: R0603_100R_1%_0.1W_100PPM; Case: 0603; Mounted: Yes; Sense: No; Socket: No; SMD: Yes; Manufacturer1 Example: NIC COMPONENT; Manufacturer1 ComponentHeight: 0.55mm; HelpURL: \\cern.ch\dfs\Applications\Altium\Datasheets\R0603_NIC_NRC.pdf; Author: CERN DEM JLC; CreateDate: 03.12.2007; LatestRevisionDate: 13.03.2008
R33 R34 = R0402_3K3_1%_0.0625W_100PPM: Resistor - 1%; Part Description: General Purpose Thick Film Chip Resistor; Manufacturer: GENERIC; Manufacturer1 Part Number: 232270673302L; TC: ±100ppm/°C; PressFit: No; Part Number: R0402_3K3_1%_0.0625W_100PPM; Component Kind: Standard; Component Type: Standard; Pin Count: 2; Value: 3k3; Status: Not Recommended; Power: 0.0625W; Manufacturer Part Number: R0402_3K3_1%_0.0625W_100PPM; Case: 0402; Mounted: Yes; Sense: No; Socket: No; SMD: Yes; Manufacturer1 Example: YAGEO PHYCOMP; Manufacturer1 ComponentHeight: 0.4mm; HelpURL: \\cern.ch\dfs\Applications\Altium\Datasheets\R0402_Phycomp_RC0402.pdf; Author: CERN DEM JLC; CreateDate: 03.12.2007; LatestRevisionDate: 17.10.2012
R45 R47 = R0603_4K42_0.1%_0.063W_10PPM: Resistor - 0.1%; Part Description: Thin Film Chip Resistor; Manufacturer: GENERIC; Manufacturer1 Part Number: RN73C1J4K42BTDF; Power: 0.063W; TC: ±10ppm; PressFit: No; Part Number: R0603_4K42_0.1%_0.063W_10PPM; Component Kind: Standard; Component Type: Standard; Pin Count: 2; Value: 4k42; Status: Not Recommended; Manufacturer Part Number: R0603_4K42_0.1%_0.063W_10PPM; Case: 0603; Mounted: Yes; Sense: No; Socket: No; SMD: Yes; Manufacturer1 Example: TYCO HOLSWORTHY; Manufacturer1 ComponentHeight: 0.5mm; HelpURL: \\cern.ch\dfs\Applications\Altium\Datasheets\R0603_Tyco_RN73.pdf; Author: CERN DEM JLC; CreateDate: 03.12.2007; LatestRevisionDate: 13.03.2008
RL1 RL2 = REL_PICKERING_116-1-A-5/2: SPST (1 Form A) Very High Packing Density SIL Reed Relay, 116 Serie; Part Description: SPST (1 Form A) Very High Packing Density SIL Reed Relay, 116 Series; Manufacturer: PICKERING ELECTRONICS; PressFit: No; Value: 5VDC; Part Number: REL_PICKERING_116-1-A-5/2; Component Kind: Standard; Component Type: Standard; Pin Count: 8; PackageDescription: 4 Leads, Body 6.86 x 3.81mm, 1Form A SIL Reed Relay, 116 Series; Mounted: Yes; Socket: No; SMD: No; Sense: No; Status: None; Manufacturer Part Number: 116-1-A-5/2; ComponentHeight: 12.6mm; HelpURL: \\cern.ch\dfs\Applications\Altium\Datasheets\REL_PICKERING_116.pdf; Author: CERN DEM JLC; CreateDate: 31.05.2011; LatestRevisionDate: 07.03.2017
SW1 SW2 = AQY221N3M: PhotoMOS Relay; Part Description: Micro-miniature SON Package Lower Output Capacitance and On Resistance (C×R5) 25V Load Voltage PhotoMOS Relay; Manufacturer: PANASONIC ELECTRIC WORKS; Table: Optocouplers; Part Number: AQY221N3M; Component Kind: Standard; Component Type: Standard; Device: AQY221N3M; PackageDescription: PANASONIC Serie AQY22(SON)  Small Outline No Lead, 4 pins, 2.2x2.95mm; Manufacturer Part Number: AQY221N3M; Pin Count: 4; Case: SON4; Mounted: Yes; Socket: No; SMD: Yes; ComponentHeight: 1.4mm; HelpURL: \\cern.ch\dfs\Applications\Altium\Datasheets\AQY221N3M.pdf; ComponentLink1Description: Package Drawing; ComponentLink1URL: \\cern.ch\dfs\Applications\Altium\Datasheets\AQY221N3M_Package-Drawing.pdf; Author: CERN DEM JLC; CreateDate: 18/01/2010; LatestRevisionDate: 18/01/2010
T1 = PMGD280UN: Dual N-Channel micro TrenchMOS™ Ultra Low Level FET; Part Description: 20V 870mA Dual N-Channel micro TrenchMOS™ Ultra Low Level FET; Manufacturer: NXP SEMICONDUCTORS; PressFit: No; Bonding: No; Part Number: PMGD280UN; Component Kind: Standard; Component Type: Standard; Device: PMGD280UN; PackageDescription: SOT363, SC70-6, 0.65mm Pitch; 6 Pin, 1.25mm W X 2.00mm L X 1.10mm H body, IPC Medium Density; Manufacturer Part Number: PMGD280UN; Pin Count: 6; Case: SOT363; Mounted: Yes; Socket: No; SMD: Yes; Sense: No; ComponentHeight: 1.1mm; HelpURL: \\cern.ch\dfs\Applications\Altium\Datasheets\PMGD280UN.pdf; Author: CERN DEM JLC; CreateDate: 19.11.2014; LatestRevisionDate: 19.11.2014
TP1 TP2 = SMD_PAD_1.27X1.27MM: Part Description: 1.27mm x 1.27mm PCB Copper Area (SMD Test Point); Mounted: No; Part Number: SMD_PAD_1.27X1.27MM; Component Type: Standard (No BOM); Pin Count: 1; Family: Test Point; Socket: No; SMD: No; Sense: No; Status: None; ComponentHeight: 0mm; HelpURL: Undefined; Author: CERN DEM JLC; CreateDate: 12.01.2008; LatestRevisionDate: 12.01.2008; PackageDescription: 1.27mm x 1.27mm PCB Copper Area (SMD Test Point)

## Sheet AFE_CTRL_Logic.SchDoc: Shuttler AFE
size 420 x 297 mm; Author: G.Kasprowicz; CompanyName: WUT ISE; DrawnBy: G.Kasprowicz; Organization: WUT ISE; Address1: PW ISE; Address2: Nowowiejska 15/19 00-665 Warsaw; Address3: gkasprow@gmail.com; DocumentNumber: 3; Revision: 1.2; SheetNumber: 3; SheetTotal: 6; ModifiedBy: -; CheckedDate: -; Title2: Control & logic; DivGrp: WUT ISE; Designer: G.Kasprowicz; ModifiedDate: -; ProjectName: Sensor Box
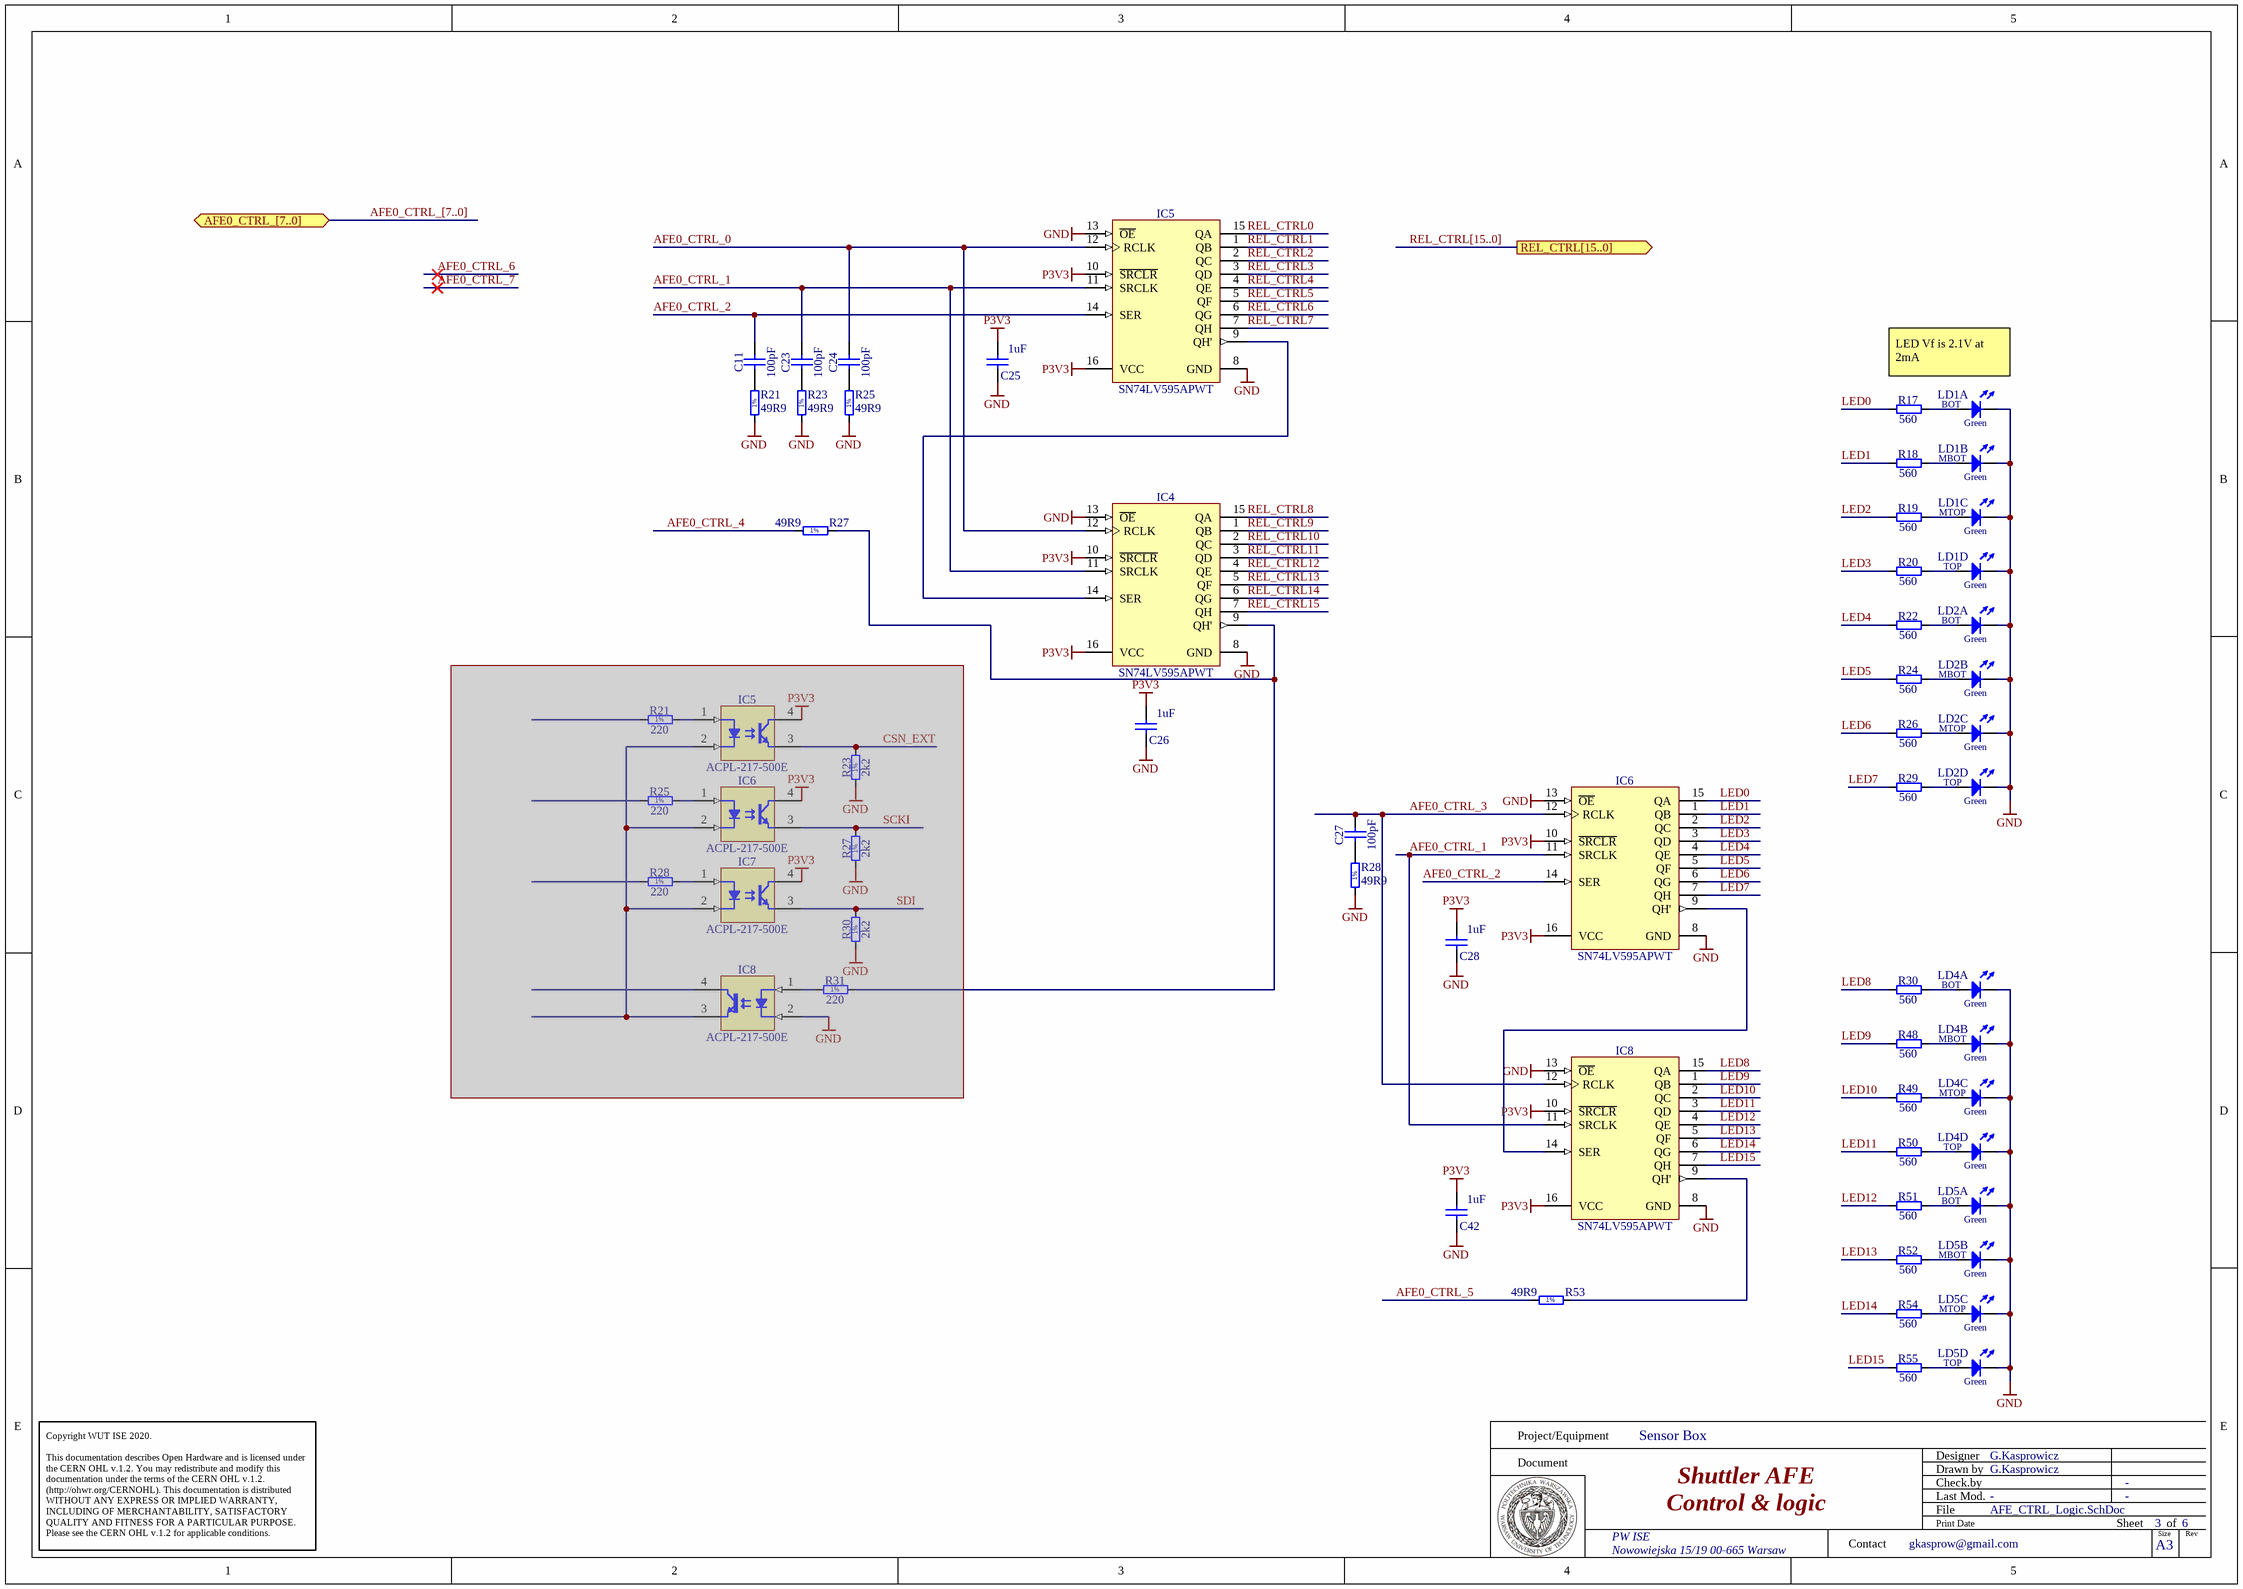
[diagram p3: AFE_CTRL_Logic.SchDoc]

### Parts
(Parts that share a designator on the sheet are numbered #1, #2 ... from top to bottom, then left to right.)
C11  100pF  [CAPC1005X55N]
C23  100pF  [CAPC1005X55N]
C24  100pF  [CAPC1005X55N]
C25  1uF  [CAPC1608X87N]
C26  1uF  [CAPC1608X87N]
C27  100pF  [CAPC1005X55N]
C28  1uF  [CAPC1608X87N]
C42  1uF  [CAPC1608X87N]
IC4  SN74LV595APWT  [SOP65P640X120-16N]
IC5#1  SN74LV595APWT  [SOP65P640X120-16N]
IC5#2  ACPL-217-500E  [SOIC127P700X242-4N]  (masked out: inside a compile mask, not in the netlist)
IC6#1  ACPL-217-500E  [SOIC127P700X242-4N]  (masked out: inside a compile mask, not in the netlist)
IC6#2  SN74LV595APWT  [SOP65P640X120-16N]
IC7#1  ACPL-217-500E  [SOIC127P700X242-4N]  (masked out: inside a compile mask, not in the netlist)
IC8#1  ACPL-217-500E  [SOIC127P700X242-4N]  (masked out: inside a compile mask, not in the netlist)
IC8#2  SN74LV595APWT  [SOP65P640X120-16N]
LD1  Green  [LED_BIVAR_H485CGDL]  (value not drawn)  (parts A,B,C,D of 4)
LD2  Green  [LED_BIVAR_H485CGDL]  (value not drawn)  (parts A,B,C,D of 4)
LD4  Green  [LED_BIVAR_H485CGDL]  (value not drawn)  (parts A,B,C,D of 4)
LD5  Green  [LED_BIVAR_H485CGDL]  (value not drawn)  (parts A,B,C,D of 4)
R17  560  [RESC1608X55N]
R18  560  [RESC1608X55N]
R19  560  [RESC1608X55N]
R20  560  [RESC1608X55N]
R21#1  49R9  [RESC1005X40N]
R21#2  220  [RESC1608X55N]  (masked out: inside a compile mask, not in the netlist)
R22  560  [RESC1608X55N]
R23#1  49R9  [RESC1005X40N]
R23#2  2k2  [RESC1005X40N]  (masked out: inside a compile mask, not in the netlist)
R24  560  [RESC1608X55N]
R25#1  49R9  [RESC1005X40N]
R25#2  220  [RESC1608X55N]  (masked out: inside a compile mask, not in the netlist)
R26  560  [RESC1608X55N]
R27#1  49R9  [RESC1005X40N]
R27#2  2k2  [RESC1005X40N]  (masked out: inside a compile mask, not in the netlist)
R28#1  220  [RESC1608X55N]  (masked out: inside a compile mask, not in the netlist)
R28#2  49R9  [RESC1005X40N]
R29  560  [RESC1608X55N]
R30#1  2k2  [RESC1005X40N]  (masked out: inside a compile mask, not in the netlist)
R30#2  560  [RESC1608X55N]
R31#1  220  [RESC1608X55N]  (masked out: inside a compile mask, not in the netlist)
R48  560  [RESC1608X55N]
R49  560  [RESC1608X55N]
R50  560  [RESC1608X55N]
R51  560  [RESC1608X55N]
R52  560  [RESC1608X55N]
R53  49R9  [RESC1005X40N]
R54  560  [RESC1608X55N]
R55  560  [RESC1608X55N]

### Ports
AFE0_CTRL_[7..0] (bidir), REL_CTRL[15..0] (out)

### Nets
GND: C25.1 C26.1 C28.1 C42.1 IC4.8(GND) IC4.13(~{OE}) IC5#1.8(GND) IC5#1.13(~{OE}) IC6#2.8(GND) IC6#2.13(~{OE}) IC8#2.8(GND) IC8#2.13(~{OE}) LD1.1(C) LD1.3(C) LD1.5(C) LD1.7(C) LD2.1(C) LD2.3(C) LD2.5(C) LD2.7(C) LD4.1(C) LD4.3(C) LD4.5(C) LD4.7(C) LD5.1(C) LD5.3(C) LD5.5(C) LD5.7(C) R21#1.1 R23#1.1 R25#1.1 R28#2.1
P3V3: C25.2 C26.2 C28.2 C42.2 IC4.10(~{SRCLR}) IC4.16(VCC) IC5#1.10(~{SRCLR}) IC5#1.16(VCC) IC6#2.10(~{SRCLR}) IC6#2.16(VCC) IC8#2.10(~{SRCLR}) IC8#2.16(VCC)
AFE0_CTRL_0: C24.2 IC4.12(RCLK) IC5#1.12(RCLK)
AFE0_CTRL_1: C23.2 IC4.11(SRCLK) IC5#1.11(SRCLK) IC6#2.11(SRCLK) IC8#2.11(SRCLK)
AFE0_CTRL_2: C11.2 IC5#1.14(SER) IC6#2.14(SER)
AFE0_CTRL_3: C27.2 IC6#2.12(RCLK) IC8#2.12(RCLK)
AFE0_CTRL_4: R27#1.1
AFE0_CTRL_5: R53.1
LED0: IC6#2.15(QA) R17.1
LED1: IC6#2.1(QB) R18.1
LED2: IC6#2.2(QC) R19.1
LED3: IC6#2.3(QD) R20.1
LED4: IC6#2.4(QE) R22.1
LED5: IC6#2.5(QF) R24.1
LED6: IC6#2.6(QG) R26.1
LED7: IC6#2.7(QH) R29.1
LED8: IC8#2.15(QA) R30#2.1
LED9: IC8#2.1(QB) R48.1
LED10: IC8#2.2(QC) R49.1
LED11: IC8#2.3(QD) R50.1
LED12: IC8#2.4(QE) R51.1
LED13: IC8#2.5(QF) R52.1
LED14: IC8#2.6(QG) R54.1
LED15: IC8#2.7(QH) R55.1
REL_CTRL0: IC5#1.15(QA)
REL_CTRL1: IC5#1.1(QB)
REL_CTRL2: IC5#1.2(QC)
REL_CTRL3: IC5#1.3(QD)
REL_CTRL4: IC5#1.4(QE)
REL_CTRL5: IC5#1.5(QF)
REL_CTRL6: IC5#1.6(QG)
REL_CTRL7: IC5#1.7(QH)
REL_CTRL8: IC4.15(QA)
REL_CTRL9: IC4.1(QB)
REL_CTRL10: IC4.2(QC)
REL_CTRL11: IC4.3(QD)
REL_CTRL12: IC4.4(QE)
REL_CTRL13: IC4.5(QF)
REL_CTRL14: IC4.6(QG)
REL_CTRL15: IC4.7(QH)
NetC11_1: C11.1 R21#1.2
NetC23_1: C23.1 R23#1.2
NetC24_1: C24.1 R25#1.2
NetC27_1: C27.1 R28#2.2
NetIC4_9: IC4.9(QH') R27#1.2
NetIC4_14: IC4.14(SER) IC5#1.9(QH')
NetIC6#2_9: IC6#2.9(QH') IC8#2.14(SER)
NetIC8#2_9: IC8#2.9(QH') R53.2
NetLD1_2: LD1.2(A) R17.2
NetLD1_4: LD1.4(A) R18.2
NetLD1_6: LD1.6(A) R19.2
NetLD1_8: LD1.8(A) R20.2
NetLD2_2: LD2.2(A) R22.2
NetLD2_4: LD2.4(A) R24.2
NetLD2_6: LD2.6(A) R26.2
NetLD2_8: LD2.8(A) R29.2
NetLD4_2: LD4.2(A) R30#2.2
NetLD4_4: LD4.4(A) R48.2
NetLD4_6: LD4.6(A) R49.2
NetLD4_8: LD4.8(A) R50.2
NetLD5_2: LD5.2(A) R51.2
NetLD5_4: LD5.4(A) R52.2
NetLD5_6: LD5.6(A) R54.2
NetLD5_8: LD5.8(A) R55.2

### Buses and harness runs
bus AFE0_CTRL_[7..0] = port AFE0_CTRL_[7..0]
bus REL_CTRL[15..0] = port REL_CTRL[15..0]

### Notes on the sheet
- LED Vf is 2.1V at 2mA
- Project/Equipment
- Document
- Designer
- Drawn by
- Check.by
- Copyright WUT ISE 2020.
  This documentation describes Open Hardware and is licensed under the CERN OHL v.1.2. You may redistribute and modify this documentation under the terms of the CERN OHL v.1.2. (http://ohwr.org/CERNOHL). This documentation is distributed WITHOUT ANY EXPRESS OR IMPLIED WARRANTY, INCLUDING OF MERCHANTABILITY, SATISFACTORY QUALITY AND FITNESS FOR A PARTICULAR PURPOSE. Please see the CERN OHL v.1.2 for applicable conditions.
- Contact
- File
- Last Mod.
- Print Date
- Sheet
- Size
- A3
- of
- Rev
- (in symbol LED_BIVAR_H485CGDL, part A) BOT
- (in symbol LED_BIVAR_H485CGDL, part B) MBOT
- (in symbol LED_BIVAR_H485CGDL, part C) MTOP
- (in symbol LED_BIVAR_H485CGDL, part D) TOP
- (in symbol R0402_2K2_1%_0.0625W_100PPM) 1%
- (in symbol R0402_49R9_1%_0.0625W_100PPM) 1%
- (in symbol R0603_220R_1%_0.1W_100PPM) 1%

### Library data of the parts
C11 C23 C24 C27 = CC0402_100PF_50V_5%_C0G: Non-polarised capacitor; Part Description: SMD Multilayer Chip Ceramic Capacitor; Manufacturer: GENERIC; Manufacturer1 Part Number: C0402C101J5GACTU; Voltage: 50V; TC: C0G/NP0; Tolerance: ±5%; Part Number: CC0402_100PF_50V_5%_C0G; Component Kind: Standard; Component Type: Standard; Pin Count: 2; Value: 100pF; Status: Preferred; Manufacturer Part Number: CC0402_100PF_50V_5%_C0G; Case: 0402; Mounted: Yes; Socket: No; SMD: Yes; Sense: No; Manufacturer1 Example: KEMET; Manufacturer1 ComponentHeight: 0.55mm; HelpURL: \\cern.ch\dfs\Applications\Altium\Datasheets\CC0402_C0G_KEMET_(Commercial Grade).pdf; Author: CERN DEM JLC; CreateDate: 03.12.2007; LatestRevisionDate: 22.04.2015
C25 C26 C28 C42 = CC0603_1UF_16V_10%_X7R: Non-polarised capacitor; Part Description: SMD Multilayer Chip Ceramic Capacitor; Manufacturer: GENERIC; Manufacturer1 Part Number: 223878615663; Voltage: 16V; TC: X7R; Tolerance: ±10%; Part Number: CC0603_1UF_16V_10%_X7R; Component Kind: Standard; Component Type: Standard; Pin Count: 2; Value: 1uF; Status: None; Manufacturer Part Number: CC0603_1UF_16V_10%_X7R; Case: 0603; Mounted: Yes; Socket: No; SMD: Yes; Sense: No; Manufacturer1 Example: YAGEO PHYCOMP; Manufacturer1 ComponentHeight: 0.9mm; HelpURL: \\cern.ch\dfs\Applications\Altium\Datasheets\CC0603_X7R_PHYCOMP.pdf; Author: CERN DEM JLC; CreateDate: 03.12.2007; LatestRevisionDate: 17.04.2015
IC4 IC5#1 IC6#2 IC8#2 = SN74LV595APWT: 8-Bit Shift Register With 3-State Output Register; Manufacturer: TEXAS INSTRUMENTS; PressFit: No; Bonding: No; Part Number: SN74LV595APWT; Component Kind: Standard; Component Type: Standard; Device: SN74LV595APWT; PackageDescription: SOP, 0.65mm pitch; 16 pin, 4.40mm W X 5.00mm L X 1.20mm H body IPC Medium Density; Part Description: 8-Bit Shift Register With 3-State Output Register; Manufacturer Part Number: SN74LV595APWT; Pin Count: 16; Case: TSSOP16; Mounted: Yes; Socket: No; SMD: Yes; Sense: No; ComponentHeight: 1.2mm; Author: CERN DEM JLC; HelpURL: \\cern.ch\dfs\Applications\Altium\Datasheets\SN74LV595APWT.pdf; CreateDate: 10.05.2012; LatestRevisionDate: 10.05.2012
IC5#2 IC6#1 IC7#1 IC8#1 = ACPL-217-500E: Single Optocoupler; Part Description: DC Input, Half-Pitch Phototransistor Optocoupler; Manufacturer: AVAGO TECHNOLOGIES; PressFit: No; Bonding: No; Part Number: ACPL-217-500E; Component Kind: Standard; Component Type: Standard; Device: ACPL-217-500E; PackageDescription: SOIC, 1.27mm, pitch; 4 pin, 2.60mm W X 4.40mm L X 2.42mm H body, IPC Medium Density; Status: Not Recommended; Manufacturer Part Number: ACPL-217-500E; Pin Count: 4; Case: SOIC4; Mounted: Yes; Socket: No; SMD: Yes; Sense: No; ComponentHeight: 2.42mm; HelpURL: \\cern.ch\dfs\Applications\Altium\Datasheets\ACPL-217-500E.pdf; Author: CERN DEM JLC; CreateDate: 11.11.2014; LatestRevisionDate: 11.11.2014
LD1 LD2 LD4 LD5 = LED_BIVAR_H485CGDL: as LD3 on sheet Shuttler_AFE; Part Number: LED_BIVAR_H485CGDL; Component Kind: Standard; Component Type: Standard; Color: Green; PackageDescription: Quad-Level 2mm Green, PCB Edge Mounting  BIVAR H485CHDL; Manufacturer Part Number: H485CGDL; Pin Count: 8; Mounted: Yes; Socket: No; SMD: No; Sense: No; ComponentHeight: 11.3mm; HelpURL: \\cern.ch\dfs\Applications\Altium\Datasheets\LED_BIVAR_H485CGDL.pdf; Author: CERN DEM JLC; CreateDate: 04.06.2012; LatestRevisionDate: 04.06.2012
R17-R20 R22 R24 R26 R29 R30#2 R48-R52 R54 R55 = R0603_560R_1%_0.1W_100PPM: as R6 on sheet Shuttler_AFE; Part Number: R0603_560R_1%_0.1W_100PPM; Component Kind: Standard; Component Type: Standard; Pin Count: 2; Value: 560; Status: Preferred; Tolerance: ±1%; Manufacturer Part Number: R0603_560R_1%_0.1W_100PPM; Case: 0603; Mounted: Yes; Sense: No; Socket: No; SMD: Yes; Manufacturer1 Example: NIC COMPONENT; Manufacturer1 ComponentHeight: 0.55mm; HelpURL: \\cern.ch\dfs\Applications\Altium\Datasheets\R0603_NIC_NRC.pdf; Author: CERN DEM JLC; CreateDate: 03.12.2007; LatestRevisionDate: 13.03.2008
R21#1 R23#1 R25#1 R27#1 R28#2 R53 = R0402_49R9_1%_0.0625W_100PPM: Resistor - 1%; Part Description: General Purpose Thick Film Chip Resistor; Manufacturer: GENERIC; Manufacturer1 Part Number: 232270674999L or RC0402FR-0749R9L; TC: ±100ppm/°C; PressFit: No; Part Number: R0402_49R9_1%_0.0625W_100PPM; Component Kind: Standard; Component Type: Standard; Pin Count: 2; Value: 49R9; Status: Not Recommended; Power: 0.0625W; Tolerance: ±1%; Manufacturer Part Number: R0402_49R9_1%_0.0625W_100PPM; Case: 0402; Mounted: Yes; Sense: No; Socket: No; SMD: Yes; Manufacturer1 Example: YAGEO PHYCOMP; Manufacturer1 ComponentHeight: 0.4mm; HelpURL: \\cern.ch\dfs\Applications\Altium\Datasheets\R0402_Phycomp_RC0402.pdf; Author: CERN DEM JLC; CreateDate: 24.10.2012; LatestRevisionDate: 24.10.2012
R21#2 R25#2 R28#1 R31#1 = R0603_220R_1%_0.1W_100PPM: Resistor - 1%; Part Description: General Purpose Thick Film Chip Resistor; Manufacturer: GENERIC; Manufacturer1 Part Number: NRC06F2200TRF; Power: 0.1W; TC: ±100ppm/°C; Part Number: R0603_220R_1%_0.1W_100PPM; Component Kind: Standard; Component Type: Standard; Pin Count: 2; Value: 220; Status: Preferred; Tolerance: ±1%; Manufacturer Part Number: R0603_220R_1%_0.1W_100PPM; Case: 0603; Mounted: Yes; Sense: No; Socket: No; SMD: Yes; Manufacturer1 Example: NIC COMPONENT; Manufacturer1 ComponentHeight: 0.55mm; HelpURL: \\cern.ch\dfs\Applications\Altium\Datasheets\R0603_NIC_NRC.pdf; Author: CERN DEM JLC; CreateDate: 03.12.2007; LatestRevisionDate: 13.03.2008
R23#2 R27#2 R30#1 = R0402_2K2_1%_0.0625W_100PPM: Resistor - 1%; Part Description: General Purpose Thick Film Chip Resistor; Manufacturer: GENERIC; Manufacturer1 Part Number: 232270672202L; TC: ±100ppm/°C; PressFit: No; Part Number: R0402_2K2_1%_0.0625W_100PPM; Component Kind: Standard; Component Type: Standard; Pin Count: 2; Value: 2k2; Status: Not Recommended; Power: 0.0625W; Tolerance: ±1%; Manufacturer Part Number: R0402_2K2_1%_0.0625W_100PPM; Case: 0402; Mounted: Yes; Sense: No; Socket: No; SMD: Yes; Manufacturer1 Example: YAGEO PHYCOMP; Manufacturer1 ComponentHeight: 0.4mm; HelpURL: \\cern.ch\dfs\Applications\Altium\Datasheets\R0402_Phycomp_RC0402.pdf; Author: CERN DEM JLC; CreateDate: 03.12.2007; LatestRevisionDate: 17.10.2012